# EAGLE design teensyShield1.4 (EAGLE 7.5.0)
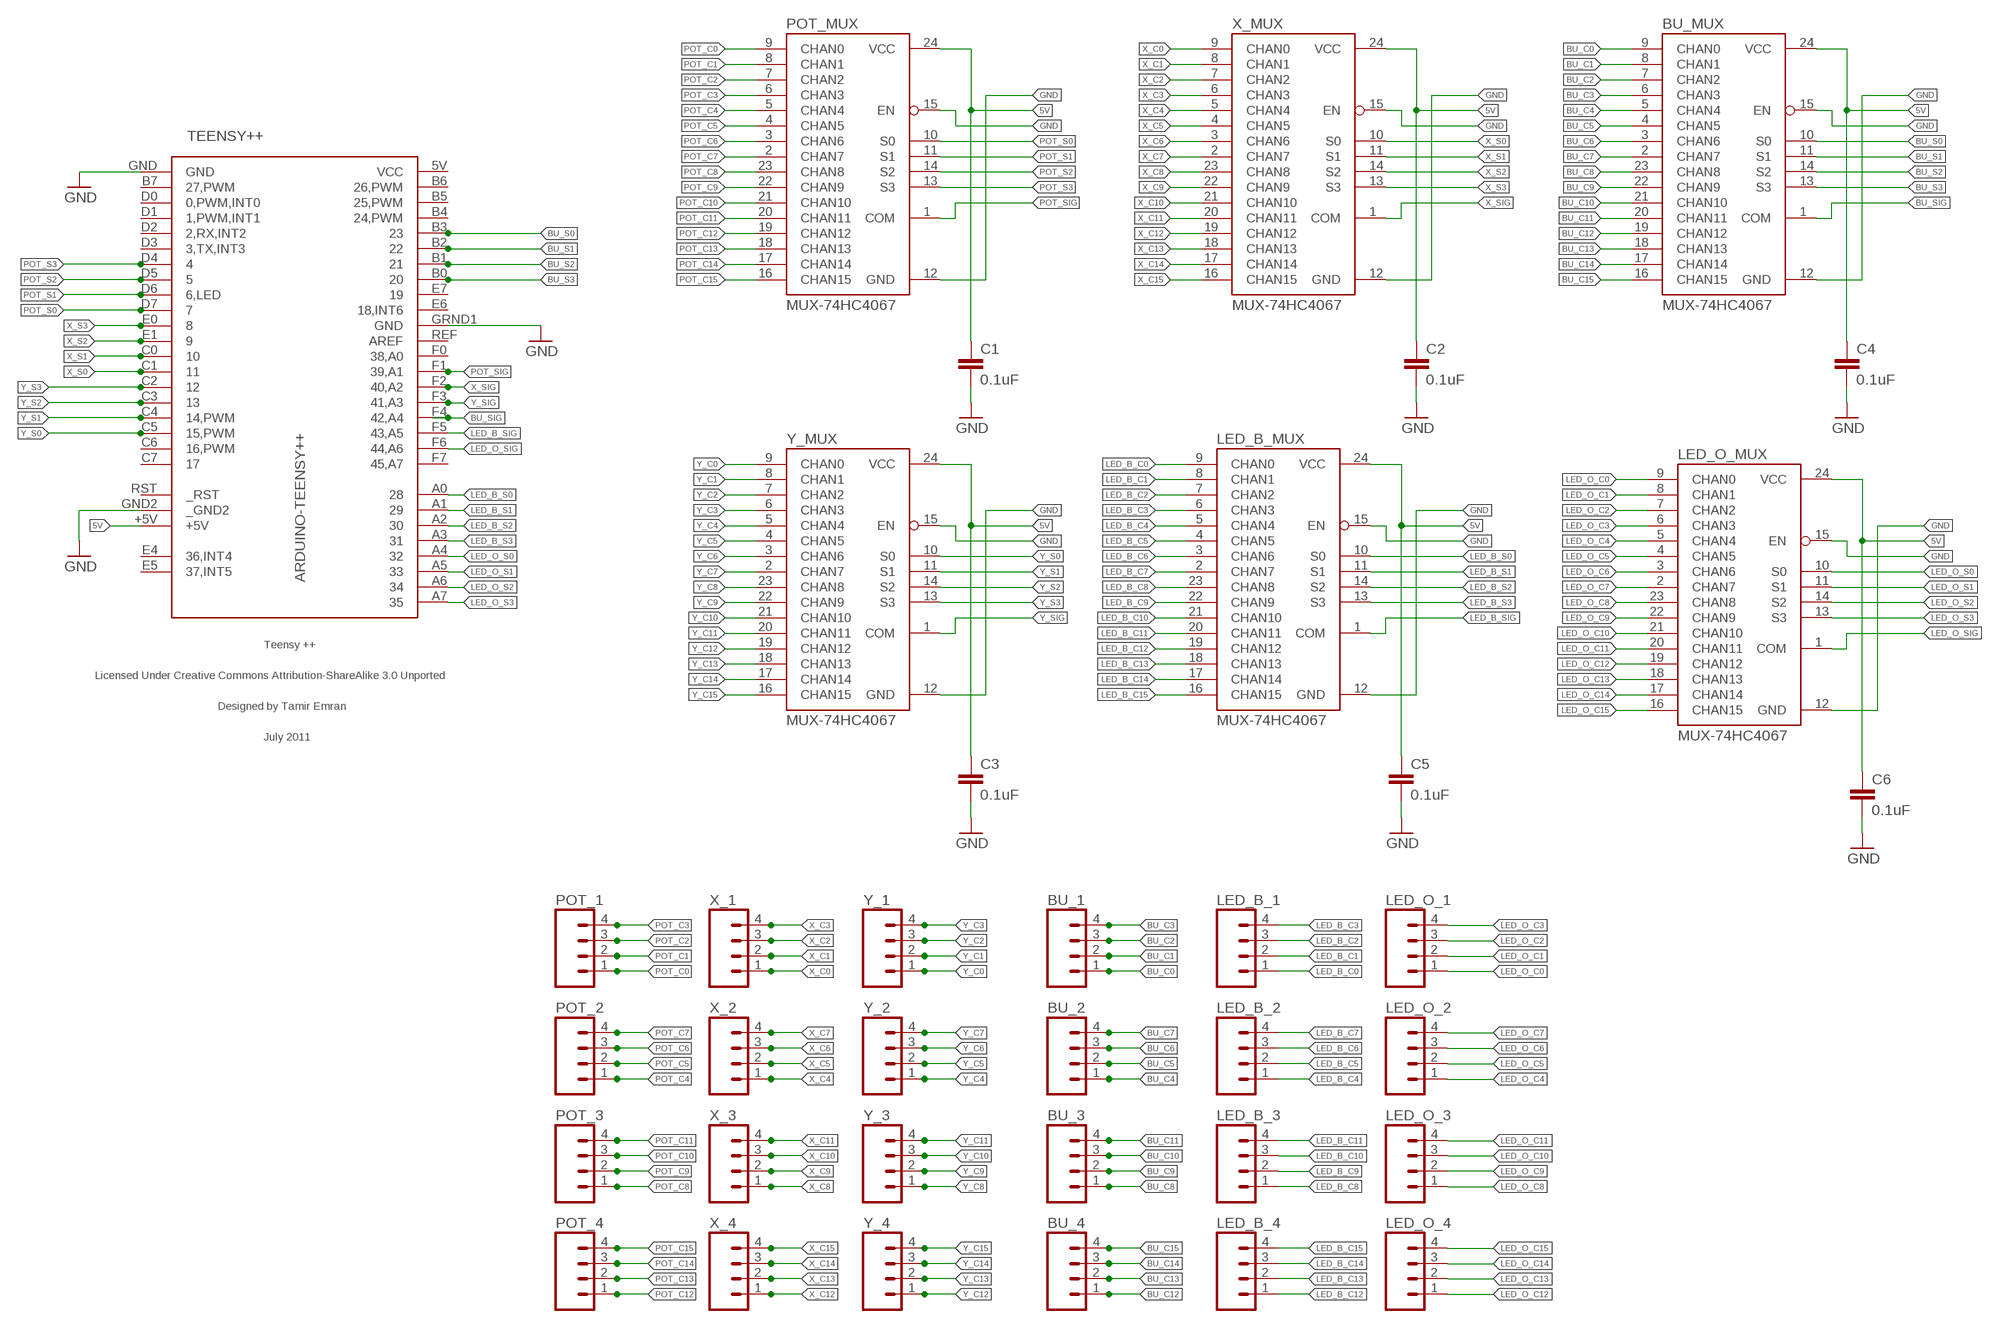
[diagram p0: schematic, sheet 1]

## Parts
BU_1  M04NO_SILK_ALL_ROUND  [1X04_NO_SILK_ALL_ROUND]
BU_2  M04NO_SILK_ALL_ROUND  [1X04_NO_SILK_ALL_ROUND]
BU_3  M04NO_SILK_ALL_ROUND  [1X04_NO_SILK_ALL_ROUND]
BU_4  M04NO_SILK_ALL_ROUND  [1X04_NO_SILK_ALL_ROUND]
BU_MUX  MUX-74HC4067  MUX-74HC4067SMD  [SSOP24]
C1  0.1uF  CAP0603  [0603]
C2  0.1uF  CAP0603  [0603]
C3  0.1uF  CAP0603  [0603]
C4  0.1uF  CAP0603  [0603]
C5  0.1uF  CAP0603  [0603]
C6  0.1uF  CAP0603  [0603]
LED_B_1  M04NO_SILK_ALL_ROUND  [1X04_NO_SILK_ALL_ROUND]
LED_B_2  M04NO_SILK_ALL_ROUND  [1X04_NO_SILK_ALL_ROUND]
LED_B_3  M04NO_SILK_ALL_ROUND  [1X04_NO_SILK_ALL_ROUND]
LED_B_4  M04NO_SILK_ALL_ROUND  [1X04_NO_SILK_ALL_ROUND]
LED_B_MUX  MUX-74HC4067  MUX-74HC4067SMD  [SSOP24]
LED_O_1  M04NO_SILK_ALL_ROUND  [1X04_NO_SILK_ALL_ROUND]
LED_O_2  M04NO_SILK_ALL_ROUND  [1X04_NO_SILK_ALL_ROUND]
LED_O_3  M04NO_SILK_ALL_ROUND  [1X04_NO_SILK_ALL_ROUND]
LED_O_4  M04NO_SILK_ALL_ROUND  [1X04_NO_SILK_ALL_ROUND]
LED_O_MUX  MUX-74HC4067  MUX-74HC4067SMD  [SSOP24]
POT_1  M04NO_SILK_ALL_ROUND  [1X04_NO_SILK_ALL_ROUND]
POT_2  M04NO_SILK_ALL_ROUND  [1X04_NO_SILK_ALL_ROUND]
POT_3  M04NO_SILK_ALL_ROUND  [1X04_NO_SILK_ALL_ROUND]
POT_4  M04NO_SILK_ALL_ROUND  [1X04_NO_SILK_ALL_ROUND]
POT_MUX  MUX-74HC4067  MUX-74HC4067SMD  [SSOP24]
TEENSY++  ARDUINO-TEENSY++  [TEENSY++]
X_1  M04NO_SILK_ALL_ROUND  [1X04_NO_SILK_ALL_ROUND]
X_2  M04NO_SILK_ALL_ROUND  [1X04_NO_SILK_ALL_ROUND]
X_3  M04NO_SILK_ALL_ROUND  [1X04_NO_SILK_ALL_ROUND]
X_4  M04NO_SILK_ALL_ROUND  [1X04_NO_SILK_ALL_ROUND]
X_MUX  MUX-74HC4067  MUX-74HC4067SMD  [SSOP24]
Y_1  M04NO_SILK_ALL_ROUND  [1X04_NO_SILK_ALL_ROUND]
Y_2  M04NO_SILK_ALL_ROUND  [1X04_NO_SILK_ALL_ROUND]
Y_3  M04NO_SILK_ALL_ROUND  [1X04_NO_SILK_ALL_ROUND]
Y_4  M04NO_SILK_ALL_ROUND  [1X04_NO_SILK_ALL_ROUND]
Y_MUX  MUX-74HC4067  MUX-74HC4067SMD  [SSOP24]

## Nets
5V: BU_MUX.24(VCC) C1.1 C2.1 C3.1 C4.1 C5.1 C6.1 LED_B_MUX.24(VCC) LED_O_MUX.24(VCC) POT_MUX.24(VCC) X_MUX.24(VCC) Y_MUX.24(VCC)
BU_C0: BU_1.1 BU_MUX.9(CHAN0)
BU_C1: BU_1.2 BU_MUX.8(CHAN1)
BU_C2: BU_1.3 BU_MUX.7(CHAN2)
BU_C3: BU_1.4 BU_MUX.6(CHAN3)
BU_C4: BU_2.1 BU_MUX.5(CHAN4)
BU_C5: BU_2.2 BU_MUX.4(CHAN5)
BU_C6: BU_2.3 BU_MUX.3(CHAN6)
BU_C7: BU_2.4 BU_MUX.2(CHAN7)
BU_C8: BU_3.1 BU_MUX.23(CHAN8)
BU_C9: BU_3.2 BU_MUX.22(CHAN9)
BU_C10: BU_3.3 BU_MUX.21(CHAN10)
BU_C11: BU_3.4 BU_MUX.20(CHAN11)
BU_C12: BU_4.1 BU_MUX.19(CHAN12)
BU_C13: BU_4.2 BU_MUX.18(CHAN13)
BU_C14: BU_4.3 BU_MUX.17(CHAN14)
BU_C15: BU_4.4 BU_MUX.16(CHAN15)
BU_S0: BU_MUX.10(S0) TEENSY++.B3
BU_S1: BU_MUX.11(S1) TEENSY++.B2
BU_S2: BU_MUX.14(S2) TEENSY++.B1
BU_S3: BU_MUX.13(S3) TEENSY++.B0
BU_SIG: BU_MUX.1(COM) TEENSY++.F4(42,A4)
GND: BU_MUX.12(GND) BU_MUX.15(EN) C1.2 C2.2 C3.2 C4.2 C5.2 C6.2 LED_B_MUX.12(GND) LED_B_MUX.15(EN) LED_O_MUX.12(GND) LED_O_MUX.15(EN) POT_MUX.12(GND) POT_MUX.15(EN) TEENSY++.GND TEENSY++.GND2(_GND2) TEENSY++.GRND1(GND) X_MUX.12(GND) X_MUX.15(EN) Y_MUX.12(GND) Y_MUX.15(EN)
LED_B_C0: LED_B_1.1 LED_B_MUX.9(CHAN0)
LED_B_C1: LED_B_1.2 LED_B_MUX.8(CHAN1)
LED_B_C2: LED_B_1.3 LED_B_MUX.7(CHAN2)
LED_B_C3: LED_B_1.4 LED_B_MUX.6(CHAN3)
LED_B_C4: LED_B_2.1 LED_B_MUX.5(CHAN4)
LED_B_C5: LED_B_2.2 LED_B_MUX.4(CHAN5)
LED_B_C6: LED_B_2.3 LED_B_MUX.3(CHAN6)
LED_B_C7: LED_B_2.4 LED_B_MUX.2(CHAN7)
LED_B_C8: LED_B_3.1 LED_B_MUX.23(CHAN8)
LED_B_C9: LED_B_3.2 LED_B_MUX.22(CHAN9)
LED_B_C10: LED_B_3.3 LED_B_MUX.21(CHAN10)
LED_B_C11: LED_B_3.4 LED_B_MUX.20(CHAN11)
LED_B_C12: LED_B_4.1 LED_B_MUX.19(CHAN12)
LED_B_C13: LED_B_4.2 LED_B_MUX.18(CHAN13)
LED_B_C14: LED_B_4.3 LED_B_MUX.17(CHAN14)
LED_B_C15: LED_B_4.4 LED_B_MUX.16(CHAN15)
LED_B_S0: LED_B_MUX.10(S0) TEENSY++.A0
LED_B_S1: LED_B_MUX.11(S1) TEENSY++.A1
LED_B_S2: LED_B_MUX.14(S2) TEENSY++.A2
LED_B_S3: LED_B_MUX.13(S3) TEENSY++.A3
LED_B_SIG: LED_B_MUX.1(COM)
LED_O_C0: LED_O_1.1 LED_O_MUX.9(CHAN0)
LED_O_C1: LED_O_1.2 LED_O_MUX.8(CHAN1)
LED_O_C2: LED_O_1.3 LED_O_MUX.7(CHAN2)
LED_O_C3: LED_O_1.4 LED_O_MUX.6(CHAN3)
LED_O_C4: LED_O_2.1 LED_O_MUX.5(CHAN4)
LED_O_C5: LED_O_2.2 LED_O_MUX.4(CHAN5)
LED_O_C6: LED_O_2.3 LED_O_MUX.3(CHAN6)
LED_O_C7: LED_O_2.4 LED_O_MUX.2(CHAN7)
LED_O_C8: LED_O_3.1 LED_O_MUX.23(CHAN8)
LED_O_C9: LED_O_3.2 LED_O_MUX.22(CHAN9)
LED_O_C10: LED_O_3.3 LED_O_MUX.21(CHAN10)
LED_O_C11: LED_O_3.4 LED_O_MUX.20(CHAN11)
LED_O_C12: LED_O_4.1 LED_O_MUX.19(CHAN12)
LED_O_C13: LED_O_4.2 LED_O_MUX.18(CHAN13)
LED_O_C14: LED_O_4.3 LED_O_MUX.17(CHAN14)
LED_O_C15: LED_O_4.4 LED_O_MUX.16(CHAN15)
LED_O_S0: LED_O_MUX.10(S0) TEENSY++.A4
LED_O_S1: LED_O_MUX.11(S1) TEENSY++.A5
LED_O_S2: LED_O_MUX.14(S2) TEENSY++.A6
LED_O_S3: LED_O_MUX.13(S3) TEENSY++.A7
LED_O_SIG: LED_O_MUX.1(COM)
N$1: TEENSY++.F2(40,A2)
N$2: TEENSY++.F1(39,A1)
N$3: TEENSY++.F5(43,A5)
N$4: TEENSY++.+5V
N$5: TEENSY++.F6(44,A6)
POT_C0: POT_1.1 POT_MUX.9(CHAN0)
POT_C1: POT_1.2 POT_MUX.8(CHAN1)
POT_C2: POT_1.3 POT_MUX.7(CHAN2)
POT_C3: POT_1.4 POT_MUX.6(CHAN3)
POT_C4: POT_2.1 POT_MUX.5(CHAN4)
POT_C5: POT_2.2 POT_MUX.4(CHAN5)
POT_C6: POT_2.3 POT_MUX.3(CHAN6)
POT_C7: POT_2.4 POT_MUX.2(CHAN7)
POT_C8: POT_3.1 POT_MUX.23(CHAN8)
POT_C9: POT_3.2 POT_MUX.22(CHAN9)
POT_C10: POT_3.3 POT_MUX.21(CHAN10)
POT_C11: POT_3.4 POT_MUX.20(CHAN11)
POT_C12: POT_4.1 POT_MUX.19(CHAN12)
POT_C13: POT_4.2 POT_MUX.18(CHAN13)
POT_C14: POT_4.3 POT_MUX.17(CHAN14)
POT_C15: POT_4.4 POT_MUX.16(CHAN15)
POT_S0: POT_MUX.10(S0) TEENSY++.D7
POT_S1: POT_MUX.11(S1) TEENSY++.D6(6,LED)
POT_S2: POT_MUX.14(S2) TEENSY++.D5
POT_S3: POT_MUX.13(S3) TEENSY++.D4
POT_SIG: POT_MUX.1(COM)
X_C0: X_1.1 X_MUX.9(CHAN0)
X_C1: X_1.2 X_MUX.8(CHAN1)
X_C2: X_1.3 X_MUX.7(CHAN2)
X_C3: X_1.4 X_MUX.6(CHAN3)
X_C4: X_2.1 X_MUX.5(CHAN4)
X_C5: X_2.2 X_MUX.4(CHAN5)
X_C6: X_2.3 X_MUX.3(CHAN6)
X_C7: X_2.4 X_MUX.2(CHAN7)
X_C8: X_3.1 X_MUX.23(CHAN8)
X_C9: X_3.2 X_MUX.22(CHAN9)
X_C10: X_3.3 X_MUX.21(CHAN10)
X_C11: X_3.4 X_MUX.20(CHAN11)
X_C12: X_4.1 X_MUX.19(CHAN12)
X_C13: X_4.2 X_MUX.18(CHAN13)
X_C14: X_4.3 X_MUX.17(CHAN14)
X_C15: X_4.4 X_MUX.16(CHAN15)
X_S0: TEENSY++.C1 X_MUX.10(S0)
X_S1: TEENSY++.C0 X_MUX.11(S1)
X_S2: TEENSY++.E1 X_MUX.14(S2)
X_S3: TEENSY++.E0 X_MUX.13(S3)
X_SIG: X_MUX.1(COM)
Y_C0: Y_1.1 Y_MUX.9(CHAN0)
Y_C1: Y_1.2 Y_MUX.8(CHAN1)
Y_C2: Y_1.3 Y_MUX.7(CHAN2)
Y_C3: Y_1.4 Y_MUX.6(CHAN3)
Y_C4: Y_2.1 Y_MUX.5(CHAN4)
Y_C5: Y_2.2 Y_MUX.4(CHAN5)
Y_C6: Y_2.3 Y_MUX.3(CHAN6)
Y_C7: Y_2.4 Y_MUX.2(CHAN7)
Y_C8: Y_3.1 Y_MUX.23(CHAN8)
Y_C9: Y_3.2 Y_MUX.22(CHAN9)
Y_C10: Y_3.3 Y_MUX.21(CHAN10)
Y_C11: Y_3.4 Y_MUX.20(CHAN11)
Y_C12: Y_4.1 Y_MUX.19(CHAN12)
Y_C13: Y_4.2 Y_MUX.18(CHAN13)
Y_C14: Y_4.3 Y_MUX.17(CHAN14)
Y_C15: Y_4.4 Y_MUX.16(CHAN15)
Y_S0: TEENSY++.C5(15,PWM) Y_MUX.10(S0)
Y_S1: TEENSY++.C4(14,PWM) Y_MUX.11(S1)
Y_S2: TEENSY++.C3 Y_MUX.14(S2)
Y_S3: TEENSY++.C2 Y_MUX.13(S3)
Y_SIG: TEENSY++.F3(41,A3) Y_MUX.1(COM)
Unconnected: TEENSY++.B4(24,PWM) TEENSY++.B5(25,PWM) TEENSY++.B6(26,PWM) TEENSY++.B7(27,PWM) TEENSY++.C6(16,PWM) TEENSY++.C7 TEENSY++.D0(0,PWM,INT0) TEENSY++.D1(1,PWM,INT1) TEENSY++.D2(2,RX,INT2) TEENSY++.D3(3,TX,INT3) TEENSY++.E4(36,INT4) TEENSY++.E5(37,INT5) TEENSY++.E6(18,INT6) TEENSY++.E7 TEENSY++.F0(38,A0) TEENSY++.F7(45,A7) TEENSY++.REF(AREF) TEENSY++.RST(_RST)

## Power pins joined to a net without a drawn wire
VCC: TEENSY++.5V(VCC)

## Library data of the parts
BU_1-BU_4 LED_B_1-LED_B_4 LED_O_1-LED_O_4 POT_1-POT_4 X_1-X_4 Y_1-Y_4 = SparkFun-Connectors:M04: Header 4 Standard 4-pin 0.1" header. Use with straight break away headers (SKU : PRT-00116), right angle break away headers (PRT-00553), swiss pins (PRT-00743), machine pins (PRT-00117), and female headers (PRT-00115). Molex polarized connector foot print use with SKU : PRT-08231 with associated crimp pins and housings. 1MM SMD Version SKU: PRT-10208; PROD_ID: CONN-09696
BU_MUX LED_B_MUX LED_O_MUX POT_MUX X_MUX Y_MUX = SparkFun:MUX-74HC4067
C1-C6 = SparkFun:CAP: Capacitor Standard 0603 ceramic capacitor, and 0.1" leaded capacitor.
TEENSY++ = teensypp:ARDUINO-TEENSY++: Teensy ++ Original Design by Mark Gross Modified Design by Tamir Emran Licensed Under Creative Commons Attribution-ShareAlike 3.0 Unported (CC BY-SA 3.0)

## Board
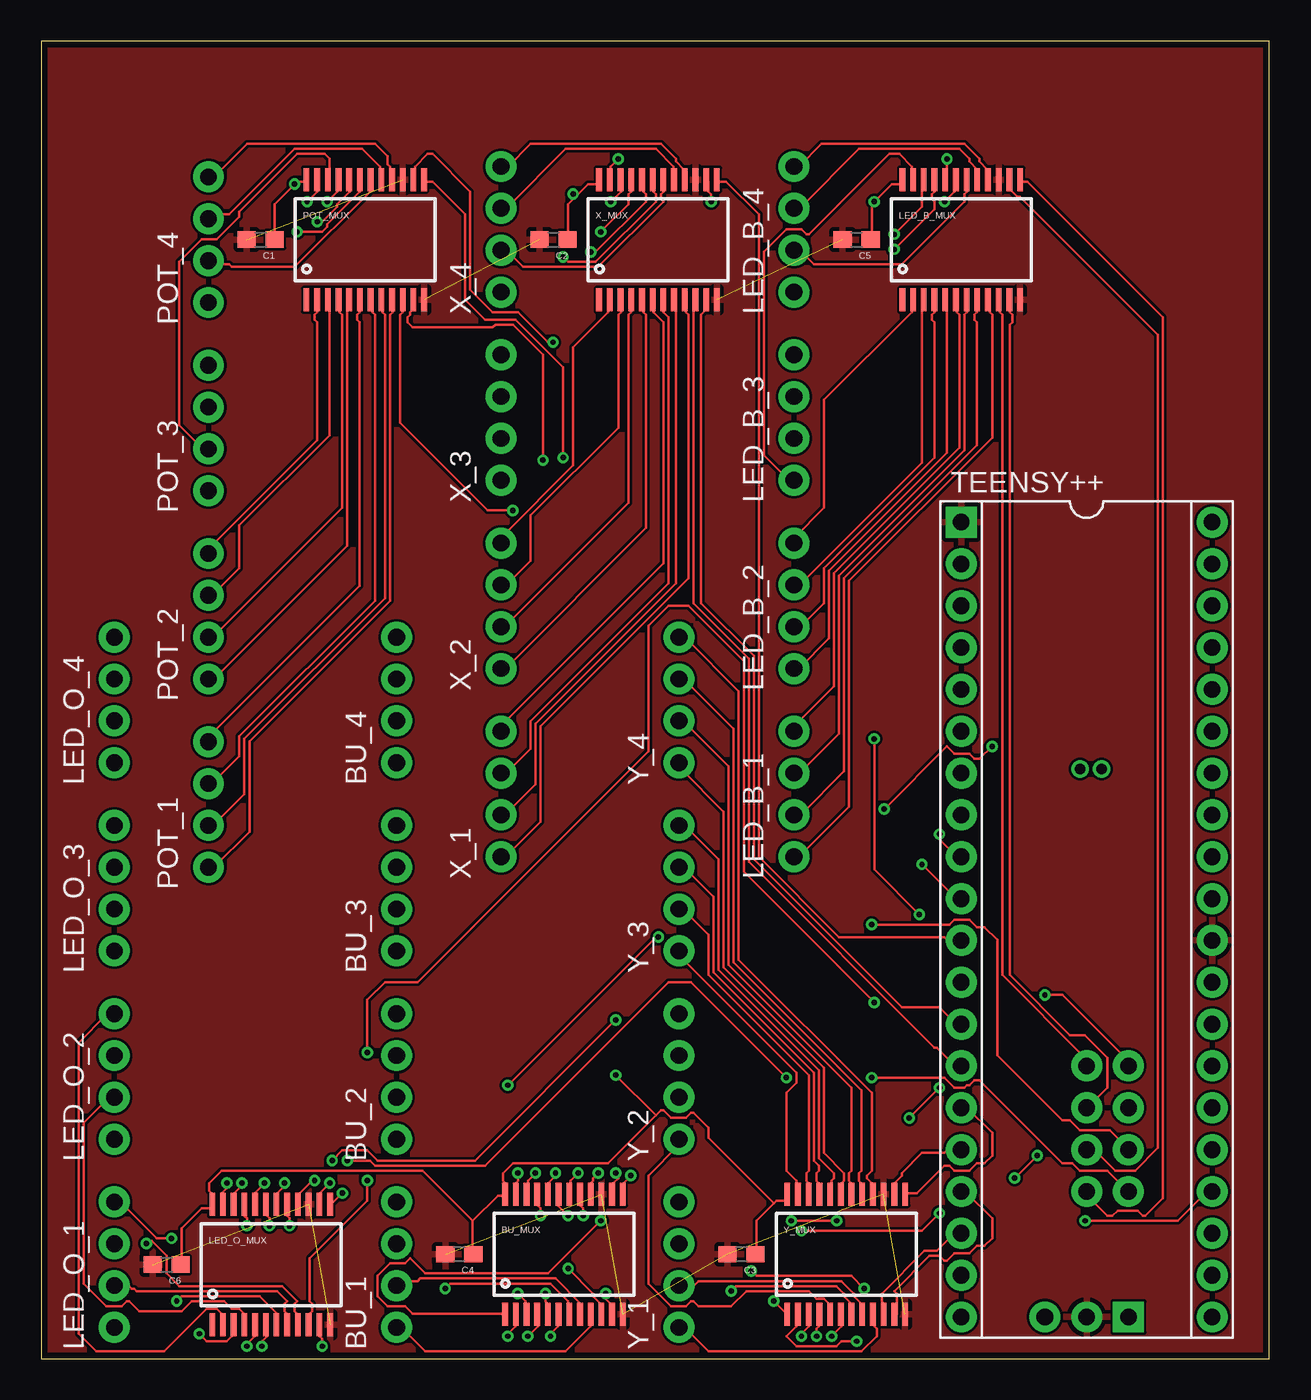
[diagram p1: board, top side]
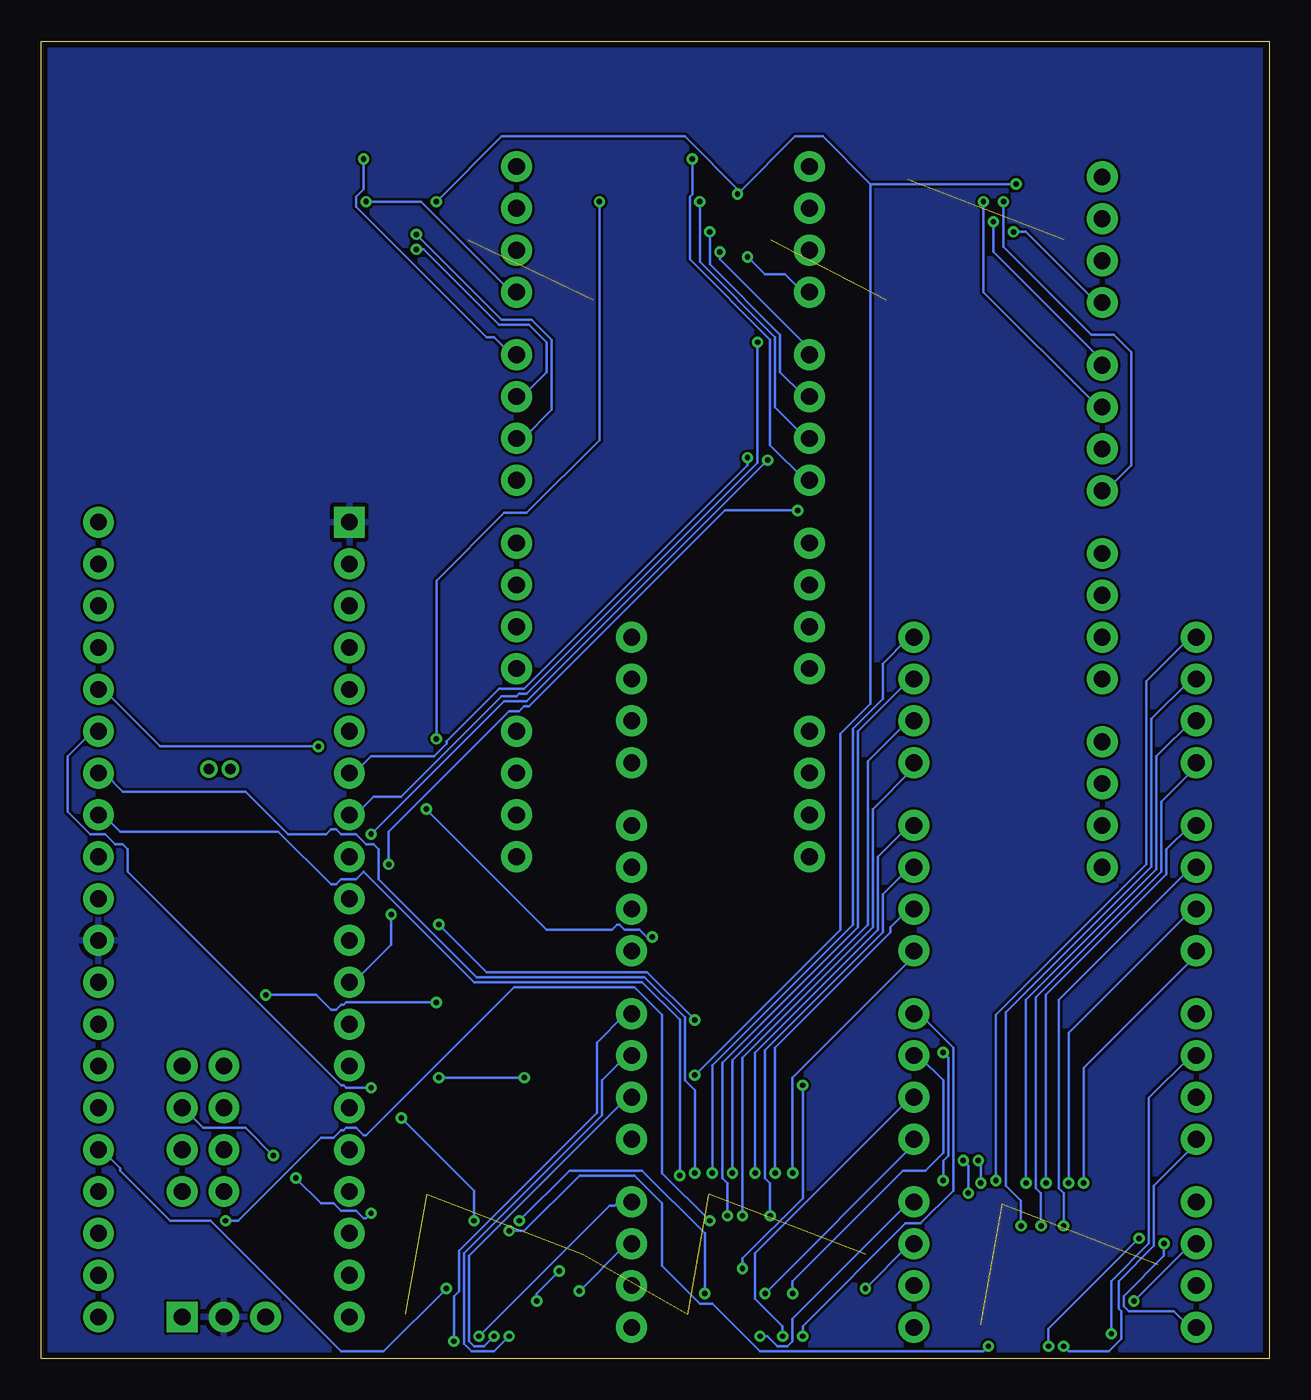
[diagram p2: board, bottom side, seen from below]

Size 74.6 x 80 mm. Coordinates in mm from the lower left corner, seen from the top.
Outline: 0,0 74.6,0 74.6,80 0,80 0,0
Copper layers (1*16): Top 0.0356mm / dielectric 1.5011mm / Bottom 0.0356mm
Design rules "oshpark-2layer": minimum track width 6mil, minimum drill 13mil, track to track 6mil, track to pad 6mil, pad to pad 6mil, via to via 6mil, smd to smd 6mil, copper to edge 15mil, drill to drill 6mil, minimum pad ring 7mil, minimum via ring 7mil, stop-mask expansion 2.5mil, vias tented up to drill 0mil, thermal gap 10mil

### Footprints (pad centres in the part's own frame; a part is rotated, then mirrored left to right if it is on the bottom)
1X04_NO_SILK_ALL_ROUND = drill 1.016 pad 1.88: 1 0,0; 2 2.54,0; 3 5.08,0; 4 7.62,0
SSOP24 = smd 0.348 x 1.397: 1 -3.575,-3.656; 2 -2.925,-3.656; 3 -2.275,-3.656; 4 -1.625,-3.656; 5 -0.975,-3.656; 6 -0.325,-3.656; 7 0.325,-3.656; 8 0.975,-3.656; 9 1.625,-3.656; 10 2.275,-3.656; 11 2.925,-3.656; 12 3.575,-3.656; 13 3.575,3.656; 14 2.925,3.656; 15 2.275,3.656; 16 1.625,3.656; 17 0.975,3.656; 18 0.325,3.656; 19 -0.325,3.656; 20 -0.975,3.656; 21 -1.625,3.656; 22 -2.275,3.656; 23 -2.925,3.656; 24 -3.575,3.656
0603 = smd 1.1 x 1: 1 -0.85,0; 2 0.85,0
TEENSY++ = drill 1.016 pad 1.88: 5V 24.13,-2.54; +5V -24.13,7.62; A0 8.89,0; A1 11.43,0; A2 13.97,0; A3 16.51,0; A4 8.89,2.54; A5 11.43,2.54; A6 13.97,2.54; A7 16.51,2.54; B0 -6.35,7.62; B1 -8.89,7.62; B2 -11.43,7.62; B3 -13.97,7.62; B4 -16.51,7.62; B5 -19.05,7.62; B6 -21.59,7.62; B7 -21.59,-7.62; C0 6.35,-7.62; C1 8.89,-7.62; C2 11.43,-7.62; C3 13.97,-7.62; C4 16.51,-7.62; C5 19.05,-7.62; C6 21.59,-7.62; C7 24.13,-7.62; D0 -19.05,-7.62; D1 -16.51,-7.62; D2 -13.97,-7.62; D3 -11.43,-7.62; D4 -8.89,-7.62; D5 -6.35,-7.62; D6 -3.81,-7.62; D7 -1.27,-7.62; E0 1.27,-7.62; E1 3.81,-7.62; E6 -1.27,7.62; E7 -3.81,7.62; F0 6.35,7.62; F1 8.89,7.62; F2 11.43,7.62; F3 13.97,7.62; F4 16.51,7.62; F5 19.05,7.62; F6 21.59,7.62; F7 24.13,7.62; GND2 24.13,0; GRND1 1.27,7.62; REF 3.81,7.62 | drill 0.635 pad 1.067: E4 -9.144,0.914; E5 -9.144,-0.406 | drill 1.016 pad 1.88 square: GND -24.13,-7.62; RST 24.13,2.54

### Placement (x,y rotation side)
BU_1  21.59,1.91 90 top
BU_2  21.59,13.34 90 top
BU_3  21.59,24.77 90 top
BU_4  21.59,36.2 90 top
BU_MUX  31.75,6.35 0 top
C1  13.34,67.94 180 top
C2  31.11,67.94 180 top
C3  42.55,6.35 180 top
C4  25.4,6.35 180 top
C5  49.53,67.94 180 top
C6  7.62,5.71 180 top
LED_B_1  45.72,30.48 90 top
LED_B_2  45.72,41.91 90 top
LED_B_3  45.72,53.34 90 top
LED_B_4  45.72,64.77 90 top
LED_B_MUX  55.88,67.94 0 top
LED_O_1  4.45,1.91 90 top
LED_O_2  4.45,13.34 90 top
LED_O_3  4.45,24.77 90 top
LED_O_4  4.45,36.2 90 top
LED_O_MUX  13.97,5.71 0 top
POT_1  10.16,29.84 90 top
POT_2  10.16,41.27 90 top
POT_3  10.16,52.7 90 top
POT_4  10.16,64.14 90 top
POT_MUX  19.68,67.94 0 top
TEENSY++  63.5,26.67 270 top
X_1  27.94,30.48 90 top
X_2  27.94,41.91 90 top
X_3  27.94,53.34 90 top
X_4  27.94,64.77 90 top
X_MUX  37.47,67.94 0 top
Y_1  38.73,1.91 90 top
Y_2  38.73,13.34 90 top
Y_3  38.73,24.77 90 top
Y_4  38.73,36.2 90 top
Y_MUX  48.9,6.35 0 top

### Tracks (layer width: path | path; a pad name or v marks a point on that pad's centre or on a via)
5V  (via drill 0.33)
  Top 0.152: C5.1 50.44,67.97 50.44,70.1 v50.6,70.26 51.66,71.32 52.27,71.32 52.43,71.48 LED_B_MUX.24 | C1.1 14.17,67.97 14.17,70.1 v15.39,71.32 15.54,71.48 16,71.48 POT_MUX.24 | 32.46,70.56 33.22,71.32 33.83,71.32 33.98,71.48 X_MUX.24 | 32.46,70.56 32,70.1 32,67.97 C2.1 | 32.46,70.56 v32.31,70.71 | 44.5,9.45 44.65,9.6 45.11,9.6 45.41,9.91 Y_MUX.24 | 44.5,9.45 43.43,8.38 43.43,6.4 C3.1 | C6.1 8.53,5.79 8.53,7.92 9.75,9.14 10.36,9.14 10.52,9.3 LED_O_MUX.24 10.36,9.45 10.36,10.06 10.21,10.21 10.21,10.67 10.97,11.43 23.16,11.43 26.21,8.38 | 26.21,8.38 26.21,6.4 C4.1 | 26.21,8.38 27.74,9.91 28.04,9.91 BU_MUX.24 28.19,10.06 28.19,10.67 28.04,10.82 28.04,11.28 28.65,11.89 34.44,11.89 37.34,14.78 | 44.5,9.45 40.54,13.41 40.54,14.02 39.62,14.94 39.47,14.94 39.17,14.63 38.25,14.63 37.8,15.09 37.64,15.09 37.34,14.78 | 37.34,14.78 v34.9,17.22
  Bottom 0.152: 24.23,71.32 v15.39,71.32 | 24.23,71.32 27.13,74.22 28.8,74.22 32.16,70.87 | v50.6,70.26 46.63,74.22 35.51,74.22 32.16,70.87 | 32.16,70.87 v32.31,70.71 | 24.23,71.32 24.23,39.78 26.06,37.95 26.06,26.06 v34.9,17.22
BU_C0
  Top 0.152: BU_MUX.9 33.38,2.59 33.38,1.98 31.85,0.46 23.32,0.46 21.95,1.83 21.64,1.83 BU_1.1
BU_C1
  Top 0.152: BU_MUX.8 32.77,2.74 32.77,3.35 31.24,4.88 23.01,4.88 22.86,4.72 21.79,4.72 21.64,4.57 BU_1.2
BU_C2  (via drill 0.33)
  Top 0.152: v24.54,4.27 24.84,4.57 30.94,4.57 32,3.5 32,2.74 BU_MUX.7
  Bottom 0.152: v24.54,4.27 21.95,6.86 21.64,6.86 BU_1.3
BU_C3  (via drill 0.33)
  Top 0.152: v30.94,1.37 30.94,1.52 31.39,1.98 31.39,2.59 BU_MUX.6
  Bottom 0.152: v30.94,1.37 30.48,1.37 29.87,0.76 29.26,0.76 28.96,1.07 28.96,2.44 21.95,9.45 21.64,9.45 BU_1.4
BU_C4  (via drill 0.33)
  Top 0.152: v30.63,3.96 30.63,3.5 30.79,3.35 30.79,2.74 BU_MUX.5
  Bottom 0.152: v30.63,3.96 21.64,12.95 21.64,13.26 BU_2.1
BU_C5  (via drill 0.33)
  Top 0.152: v29.57,1.37 30.18,1.98 30.18,2.59 BU_MUX.4
  Bottom 0.152: v29.57,1.37 29.57,1.98 31.24,3.66 31.24,6.4 21.64,16 BU_2.2
BU_C6  (via drill 0.33)
  Top 0.152: v28.96,3.96 29.41,3.5 29.41,2.74 BU_MUX.3
  Bottom 0.152: v28.96,3.96 28.96,4.72 22.25,11.43 20.88,11.43 19.81,12.5 19.81,16.92 21.18,18.29 21.49,18.29 BU_2.3
BU_C7  (via drill 0.33)
  Top 0.152: v28.35,1.37 28.35,1.52 28.8,1.98 28.8,2.59 BU_MUX.2
  Bottom 0.152: v28.35,1.37 28.35,1.98 22.1,8.23 21.18,8.23 19.2,10.21 19.2,18.9 21.18,20.88 21.49,20.88 BU_2.4
BU_C8  (via drill 0.33)
  Top 0.152: v28.96,11.28 28.96,10.82 28.8,10.67 28.8,10.06 BU_MUX.23
  Bottom 0.152: v28.96,11.28 28.96,17.07 21.64,24.38 21.64,24.69 BU_3.1
BU_C9  (via drill 0.33)
  Top 0.152: v30.02,11.28 29.57,10.82 29.57,10.06 BU_MUX.22
  Bottom 0.152: v30.02,11.28 30.02,18.9 23.01,25.91 23.01,26.21 21.95,27.28 21.64,27.28 BU_3.2
BU_C10  (via drill 0.33)
  Top 0.152: v30.33,8.69 30.33,9.14 30.18,9.3 30.18,9.91 BU_MUX.21
  Bottom 0.152: v30.33,8.69 30.33,10.67 30.63,10.97 30.63,18.75 23.47,25.91 23.47,28.19 21.95,29.72 21.64,29.72 BU_3.3
BU_C11  (via drill 0.33)
  Top 0.152: v31.24,11.28 31.24,11.12 30.79,10.67 30.79,10.06 BU_MUX.20
  Bottom 0.152: v31.24,11.28 31.24,18.59 23.77,26.06 23.77,30.48 21.95,32.31 21.64,32.31 BU_3.4
BU_C12  (via drill 0.33)
  Top 0.152: v32,8.69 31.39,9.3 31.39,9.91 BU_MUX.19
  Bottom 0.152: v32,8.69 32,18.29 24.08,26.21 24.08,33.38 21.64,35.81 21.64,36.12 BU_4.1
BU_C13  (via drill 0.33)
  Top 0.152: v32.61,11.28 32.16,10.82 32.16,10.06 BU_MUX.18
  Bottom 0.152: v32.61,11.28 32.61,18.14 24.38,26.36 24.38,36.27 21.95,38.71 21.64,38.71 BU_4.2
BU_C14  (via drill 0.33)
  Top 0.152: v32.92,8.69 32.92,9.14 32.77,9.3 32.77,9.91 BU_MUX.17
  Bottom 0.152: v32.92,8.69 32.92,10.67 33.22,10.97 33.22,17.98 24.99,26.21 24.99,38.1 21.95,41.15 21.64,41.15 BU_4.3
BU_C15  (via drill 0.33)
  Top 0.152: v33.83,11.28 33.53,10.97 33.53,10.82 33.38,10.67 33.38,10.06 BU_MUX.16
  Bottom 0.152: v33.83,11.28 33.83,17.83 25.3,26.36 25.3,38.25 23.47,40.08 23.47,42.22 21.95,43.74 21.64,43.74 BU_4.4
BU_S0  (via drill 0.33)
  Top 0.152: v32,5.49 33.53,3.96 33.53,3.81 33.98,3.35 33.98,2.74 BU_MUX.10 | v28.35,16.61 37.34,25.6 v37.49,25.6 | v51.21,33.38 55.02,37.19 55.47,36.73 56.39,36.73 56.69,36.42 57,36.42 v57.76,37.19
  Bottom 0.152: v32,5.49 32,6.1 28.35,9.75 v28.35,16.61 | v37.49,25.6 37.64,25.45 38.25,26.06 39.17,26.06 39.47,26.36 39.62,26.36 39.93,26.06 43.89,26.06 v51.21,33.38 | v57.76,37.19 67.36,37.19 70.71,40.54 71.02,40.54 TEENSY++.B3
BU_S1  (via drill 0.33)
  Top 0.152: v34.29,3.96 34.29,3.66 34.59,3.35 34.59,2.74 BU_MUX.11 | v48.31,8.38 v45.57,8.38 | v54.56,16.46 v52.73,14.63
  Bottom 0.152: v34.29,3.96 34.29,7.62 38.1,11.43 42.52,11.43 v45.57,8.38 | v48.31,8.38 48.31,10.21 v52.73,14.63 | v54.56,16.46 56.08,16.46 56.24,16.61 56.39,16.61 69.34,29.57 69.34,30.94 69.65,31.24 70.1,31.24 70.71,31.85 71.63,31.85 73,33.22 73,36.58 71.48,38.1 TEENSY++.B2
BU_S2  (via drill 0.33)
  Top 0.152: v34.9,11.28 35.05,11.12 35.05,10.97 34.75,10.67 34.75,10.06 BU_MUX.14
  Bottom 0.152: v34.9,11.28 34.9,16.31 35.51,16.92 35.51,20.73 37.95,23.16 48.16,23.16 54.1,29.11 54.1,30.94 54.41,31.24 54.86,31.24 55.47,31.85 56.39,31.85 56.69,32.16 57,32.16 57.3,31.85 59.59,31.85 62.18,34.44 69.65,34.44 70.71,35.51 71.02,35.51 TEENSY++.B1
BU_S3  (via drill 0.33)
  Top 0.152: v35.81,11.12 35.36,10.67 35.36,10.06 BU_MUX.13
  Bottom 0.152: v35.81,11.12 35.81,20.57 38.1,22.86 48.31,22.86 55.02,29.57 55.47,29.11 56.39,29.11 56.69,28.8 57,28.8 60.2,32 69.8,32 70.71,32.92 71.02,32.92 TEENSY++.B0
BU_SIG  (via drill 0.33)
  Top 0.152: v33.98,8.38 30.79,5.18 23.32,5.18 22.4,6.1 22.1,5.79 21.18,5.79 20.42,5.03 20.42,3.81 21.03,3.2 22.1,3.2 22.55,2.74 28.04,2.74 BU_MUX.1 | v63.4,8.38 69.04,8.38 70.71,10.06 71.02,10.06 TEENSY++.F4
  Bottom 0.152: v33.98,8.38 36.88,11.28 36.88,20.88 38.56,22.55 45.87,22.55 54.86,13.56 55.02,13.56 55.47,14.02 56.08,14.02 56.24,13.87 56.39,13.87 56.84,13.41 57.61,13.41 62.64,8.38 v63.4,8.38
GND  (10 unrouted)
  pour Top: 0,0 74.93,0 74.93,80.01 0,80.01
  pour Bottom: 0,0 74.93,0 74.93,80.01 0,80.01
LED_B_C0
  Top 0.152: LED_B_1.1 46.02,30.48 49.07,33.53 49.07,47.24 57.76,55.93 57.76,63.4 57.61,63.55 57.61,64.16 LED_B_MUX.9
LED_B_C1
  Top 0.152: LED_B_MUX.8 56.84,64.16 56.84,63.55 56.69,63.4 56.69,63.09 56.84,62.94 56.84,55.47 48.77,47.4 48.77,35.66 46.18,33.07 45.72,33.07 LED_B_1.2
LED_B_C2
  Top 0.152: LED_B_MUX.7 56.24,64.16 56.24,63.55 56.08,63.4 56.08,55.17 48.46,47.55 48.46,37.95 46.18,35.66 45.72,35.66 LED_B_1.3
LED_B_C3
  Top 0.152: LED_B_1.4 45.72,38.41 48.16,40.84 48.16,47.7 55.78,55.32 55.78,63.4 55.63,63.55 55.63,64.16 LED_B_MUX.6
LED_B_C4
  Top 0.152: LED_B_2.1 46.02,41.91 47.85,43.74 47.85,47.85 55.02,55.02 55.02,64.16 LED_B_MUX.5
LED_B_C5
  Top 0.152: LED_B_MUX.4 54.25,64.16 54.25,63.55 54.1,63.4 54.1,63.09 54.25,62.94 54.25,54.71 47.55,48.01 47.55,45.87 46.18,44.5 45.72,44.5 LED_B_2.2
LED_B_C6
  Top 0.152: LED_B_MUX.3 53.49,64.16 53.49,54.41 46.18,47.09 45.72,47.09 LED_B_2.3
LED_B_C7
  Top 0.152: LED_B_2.4 45.72,49.84 47.55,51.66 47.55,58.22 52.88,63.55 52.88,64.16 LED_B_MUX.2
LED_B_C8
  Top 0.152: LED_B_3.1 45.41,53.34 43.89,54.86 43.89,67.21 45.26,68.58 46.18,68.58 46.48,68.28 46.63,68.28 51.51,73.15 52.12,73.15 52.88,72.39 52.88,71.63 LED_B_MUX.23
LED_B_C9  (via drill 0.33)
  Top 0.152: v51.82,68.28 53.49,69.95 53.49,71.48 LED_B_MUX.22
  Bottom 0.152: v51.82,68.28 46.63,63.09 44.81,63.09 43.59,61.87 43.59,57.61 45.26,55.93 45.72,55.93 LED_B_3.2
LED_B_C10  (via drill 0.33)
  Top 0.152: v51.82,67.36 54.25,69.8 54.25,70.26 54.1,70.41 54.1,70.71 54.25,70.87 54.25,71.48 LED_B_MUX.21
  Bottom 0.152: v51.82,67.36 51.36,67.36 46.79,62.79 44.96,62.79 43.89,61.72 43.89,59.89 45.26,58.52 45.72,58.52 LED_B_3.3
LED_B_C11  (via drill 0.33)
  Top 0.152: v55.02,72.85 55.02,71.63 LED_B_MUX.20
  Bottom 0.152: v55.02,72.85 55.02,71.02 55.47,70.56 55.47,69.95 47.55,62.03 47.09,62.03 46.02,60.96 LED_B_3.4
LED_B_C12  (via drill 0.33)
  Top 0.152: v54.86,70.26 55.47,70.87 55.47,71.48 LED_B_MUX.19
  Bottom 0.152: v54.86,70.26 51.51,70.26 46.02,64.77 LED_B_4.1
LED_B_C13
  Top 0.152: LED_B_MUX.18 56.24,71.48 56.24,70.87 56.08,70.71 56.08,70.26 52.27,66.45 46.94,66.45 46.18,67.21 45.72,67.21 LED_B_4.2
LED_B_C14
  Top 0.152: LED_B_MUX.17 56.84,71.63 56.84,72.24 56.39,72.69 56.39,72.85 55.78,73.46 49.68,73.46 46.18,69.95 45.72,69.95 LED_B_4.3
LED_B_C15
  Top 0.152: LED_B_4.4 46.02,72.39 47.4,73.76 56.08,73.76 57,72.85 57,72.69 57.45,72.24 57.45,71.63 LED_B_MUX.16
LED_B_S0
  Top 0.152: LED_B_MUX.10 58.22,64.16 58.22,63.55 58.37,63.4 58.37,23.32 63.4,18.29 63.4,17.83 TEENSY++.A0
LED_B_S1
  Top 0.152: LED_B_MUX.11 58.83,64.16 58.83,63.55 58.98,63.4 58.98,62.94 58.83,62.79 58.83,23.32 62.48,19.66 63.4,19.66 64.77,18.29 64.77,16.46 63.55,15.24 TEENSY++.A1
LED_B_S2
  Top 0.152: LED_B_MUX.14 58.83,71.48 58.83,71.02 59.28,70.56 59.44,70.56 67.82,62.18 67.82,12.8 66.45,11.43 65.23,11.43 64.01,12.65 63.55,12.65 TEENSY++.A2
LED_B_S3
  Top 0.152: LED_B_MUX.13 59.59,71.48 59.89,71.48 68.12,63.25 68.12,9.75 67.06,8.69 66.9,8.69 66.6,8.99 65.38,8.99 65.08,8.69 64.77,8.69 63.4,10.06 TEENSY++.A3
LED_O_C0  (via drill 0.33)
  Top 0.152: v6.4,7.01 6.55,7.16 6.71,7.16 7.62,6.25 7.62,5.18 8.38,4.42 14.63,4.42 15.54,3.5 15.39,3.35 15.39,2.9 15.54,2.74 15.54,2.13 LED_O_MUX.9
  Bottom 0.152: v6.4,7.01 6.4,6.25 8.84,3.81 8.84,3.2 8.53,2.9 5.79,2.9 4.88,1.98 4.57,1.98 LED_O_1.1
LED_O_C1
  Top 0.152: LED_O_MUX.8 14.94,2.13 14.94,2.74 14.78,2.9 14.78,3.35 14.94,3.5 14.33,4.12 5.79,4.12 5.64,4.27 5.49,4.27 5.33,4.42 4.57,4.42 LED_O_1.2
LED_O_C2  (via drill 0.33)
  Top 0.152: v8.23,3.5 8.53,3.81 13.26,3.81 14.33,2.74 14.33,2.13 LED_O_MUX.7
  Bottom 0.152: v8.23,3.5 4.88,6.86 4.57,6.86 LED_O_1.3
LED_O_C3  (via drill 0.33)
  Top 0.152: v13.41,0.76 13.41,1.07 13.72,1.37 13.72,1.98 LED_O_MUX.6 | v7.92,7.32 7.01,7.32 4.88,9.45 4.57,9.45 LED_O_1.4
  Bottom 0.152: v13.41,0.76 13.41,1.83 v7.92,7.32
LED_O_C4  (via drill 0.33)
  Top 0.152: v12.5,0.76 12.5,0.91 12.95,1.37 12.95,1.98 LED_O_MUX.5
  Bottom 0.152: v12.5,0.76 12.19,0.46 9.75,0.46 8.99,1.22 8.99,2.9 9.14,3.05 9.14,4.72 7.01,6.86 7.01,10.52 4.57,12.95 4.57,13.26 LED_O_2.1
LED_O_C5
  Top 0.152: LED_O_MUX.4 12.34,2.13 12.34,2.74 12.04,3.05 11.58,3.05 11.12,3.5 9.14,3.5 8.53,2.9 5.94,2.9 5.33,3.5 5.18,3.5 4.88,3.2 3.96,3.2 2.59,4.57 2.59,14.33 4.12,15.85 4.42,15.85 LED_O_2.2
LED_O_C6  (via drill 0.33)
  Top 0.152: v9.6,1.52 10.06,1.07 11.28,1.07 11.58,1.37 11.58,1.98 LED_O_MUX.3
  Bottom 0.152: v9.6,1.52 9.6,4.72 7.32,7.01 7.32,15.85 4.88,18.29 4.57,18.29 LED_O_2.3
LED_O_C7
  Top 0.152: LED_O_MUX.2 10.97,2.13 10.97,2.74 10.67,3.05 10.06,3.05 7.47,0.46 3.35,0.46 2.29,1.52 2.29,19.2 3.96,20.88 4.42,20.88 LED_O_2.4
LED_O_C8  (via drill 0.33)
  Top 0.152: v11.28,10.67 11.28,10.36 10.97,10.06 10.97,9.45 LED_O_MUX.23
  Bottom 0.152: v11.28,10.67 11.28,17.68 4.57,24.38 4.57,24.69 LED_O_3.1
LED_O_C9  (via drill 0.33)
  Top 0.152: v12.19,10.67 12.19,10.52 11.73,10.06 11.73,9.45 LED_O_MUX.22
  Bottom 0.152: v12.19,10.67 12.19,19.81 4.57,27.43 LED_O_3.2
LED_O_C10  (via drill 0.33)
  Top 0.152: v12.5,8.08 12.5,8.53 12.34,8.69 12.34,9.3 LED_O_MUX.21
  Bottom 0.152: v12.5,8.08 12.5,10.06 12.8,10.36 12.8,21.79 4.88,29.72 4.57,29.72 LED_O_3.3
LED_O_C11  (via drill 0.33)
  Top 0.152: v13.56,10.67 12.95,10.06 12.95,9.45 LED_O_MUX.20
  Bottom 0.152: v13.56,10.67 13.56,22.1 6.25,29.41 6.25,30.94 4.88,32.31 4.57,32.31 LED_O_3.4
LED_O_C12  (via drill 0.33)
  Top 0.152: v13.87,8.08 13.87,8.53 13.72,8.69 13.72,9.3 LED_O_MUX.19
  Bottom 0.152: v13.87,8.08 13.87,10.06 14.17,10.36 14.17,21.95 6.55,29.57 6.55,33.83 4.57,35.81 4.57,36.12 LED_O_4.1
LED_O_C13  (via drill 0.33)
  Top 0.152: v14.78,10.67 14.78,10.52 14.33,10.06 14.33,9.45 LED_O_MUX.18
  Bottom 0.152: v14.78,10.67 14.78,21.79 6.86,29.72 6.86,36.58 4.57,38.86 LED_O_4.2
LED_O_C14  (via drill 0.33)
  Top 0.152: v15.09,8.08 15.09,8.53 14.94,8.69 14.94,9.3 LED_O_MUX.17
  Bottom 0.152: v15.09,8.08 15.09,9.6 16,10.52 16,21.03 7.16,29.87 7.16,38.86 4.88,41.15 4.57,41.15 LED_O_4.3
LED_O_C15  (via drill 0.33)
  Top 0.152: v16.61,10.82 16.46,10.82 15.7,10.06 15.7,9.45 LED_O_MUX.16
  Bottom 0.152: v16.61,10.82 16.61,20.88 7.47,30.02 7.47,41.15 4.88,43.74 4.57,43.74 LED_O_4.4
LED_O_S0  (via drill 0.33)
  Top 0.152: v19.81,10.82 19.81,9.6 16.31,6.1 16.31,3.5 16.46,3.35 16.46,2.9 16.31,2.74 16.31,2.13 LED_O_MUX.10 | v19.81,18.59 19.81,21.79 20.88,22.86 22.86,22.86 36.88,36.88 36.88,44.5 38.1,45.72 39.32,45.72 42.67,42.37 42.67,29.57 v50.6,21.64 | v60.96,22.1 62.03,22.1 65.99,18.14 65.99,17.83 TEENSY++.A4
  Bottom 0.152: v19.81,10.82 19.81,12.04 19.51,12.34 19.51,18.29 v19.81,18.59 | v50.6,21.64 56.08,21.64 56.24,21.49 56.39,21.49 56.69,21.18 57,21.18 57.91,22.1 v60.96,22.1
LED_O_S1  (via drill 0.33)
  Top 0.152: v17.07,0.76 17.07,1.22 16.92,1.37 16.92,1.98 LED_O_MUX.11 | v46.18,7.77 53.49,7.77 v54.56,8.84 | v60.5,12.34 v59.13,10.97
  Bottom 0.152: v17.07,0.76 17.37,0.46 30.94,0.46 33.83,3.35 34.59,3.35 36.88,5.64 36.88,9.45 38.56,11.12 41.91,11.12 45.26,7.77 v46.18,7.77 | v54.56,8.84 54.86,8.53 55.02,8.53 55.47,8.99 56.39,8.99 56.84,9.45 57.61,9.45 v59.13,10.97 | v60.5,12.34 62.18,14.02 64.77,14.02 65.99,15.24 TEENSY++.A5
LED_O_S2  (via drill 0.33)
  Top 0.152: v17.53,10.67 16.92,10.06 16.92,9.45 LED_O_MUX.14 | v17.68,12.04 18.29,12.65 19.81,12.65 20.42,12.04 26.36,12.04 v34.9,20.57 | v50.44,26.36 55.17,26.36 55.47,26.67 56.39,26.67 56.84,26.21 57.3,26.21 58.06,25.45 58.06,18.44 62.03,14.48 62.48,14.48 63.09,13.87 64.92,13.87 65.99,12.8 TEENSY++.A6
  Bottom 0.152: v17.53,10.67 17.53,11.89 v17.68,12.04 | v34.9,20.57 37.8,23.47 47.55,23.47 v50.44,26.36
LED_O_S3  (via drill 0.33)
  Top 0.152: v18.29,10.06 17.68,9.45 LED_O_MUX.13 | v18.59,12.04 19.96,12.04 20.27,11.73 26.98,11.73 38.1,22.86 39.47,22.86 v45.26,17.07 | v50.44,17.07 54.86,17.07 55.47,16.46 56.08,16.46 56.24,16.61 56.39,16.61 56.69,16.92 57,16.92 62.03,11.89 62.64,11.89 63.09,11.43 64.77,11.43 TEENSY++.A7
  Bottom 0.152: v18.29,10.06 18.29,11.73 v18.59,12.04 | v50.44,17.07 v45.26,17.07
POT_C0
  Top 0.152: POT_MUX.9 21.34,64.16 21.34,63.55 21.18,63.4 21.18,46.02 12.65,37.49 12.65,32 10.52,29.87 10.21,29.87 POT_1.1
POT_C1
  Top 0.152: POT_MUX.8 20.73,64.16 20.73,63.55 20.88,63.4 20.88,46.18 12.34,37.64 12.34,34.29 10.52,32.46 10.21,32.46 POT_1.2
POT_C2
  Top 0.152: POT_MUX.7 20.12,64.16 20.12,63.55 20.27,63.4 20.27,46.02 12.04,37.8 12.04,36.58 10.52,35.05 10.21,35.05 POT_1.3
POT_C3
  Top 0.152: POT_MUX.6 19.36,64.16 19.36,63.55 19.2,63.4 19.2,63.09 19.36,62.94 19.36,46.94 10.21,37.8 10.21,37.49 POT_1.4
POT_C4
  Top 0.152: POT_MUX.5 18.59,64.16 18.59,49.38 10.52,41.3 10.21,41.3 POT_2.1
POT_C5
  Top 0.152: POT_MUX.4 18.14,64.16 18.14,63.55 18.29,63.4 18.29,51.66 10.52,43.89 10.21,43.89 POT_2.2
POT_C6
  Top 0.152: POT_MUX.3 17.53,64.16 17.53,56.08 12.04,50.6 12.04,48.01 10.52,46.48 10.21,46.48 POT_2.3
POT_C7
  Top 0.152: POT_MUX.2 16.76,64.16 16.76,63.55 16.61,63.4 16.61,63.09 16.76,62.94 16.76,55.78 10.21,49.23 10.21,48.92 POT_2.4
POT_C8  (via drill 0.33)
  Top 0.152: v16.15,70.26 16.76,70.87 16.76,71.48 POT_MUX.23
  Bottom 0.152: v16.15,70.26 16.15,67.51 10.82,62.18 9.45,62.18 8.38,61.11 8.38,54.25 10.06,52.58 POT_3.1
POT_C9
  Top 0.152: POT_MUX.22 17.53,71.63 17.53,72.85 17.22,73.15 15.54,73.15 12.04,69.65 12.04,69.34 10.67,67.97 9.75,67.97 8.38,66.6 8.38,56.69 9.75,55.32 10.06,55.32 POT_3.2
POT_C10  (via drill 0.33)
  Top 0.152: v17.37,70.26 17.98,70.87 17.98,71.48 POT_MUX.21
  Bottom 0.152: v17.37,70.26 17.37,64.77 10.52,57.91 10.21,57.91 POT_3.3
POT_C11  (via drill 0.33)
  Top 0.152: v16.76,69.04 17.07,69.04 17.98,69.95 17.98,70.1 18.75,70.87 18.75,71.48 POT_MUX.20
  Bottom 0.152: v16.76,69.04 16.76,67.21 10.21,60.66 10.21,60.35 POT_3.4
POT_C12  (via drill 0.33)
  Top 0.152: v15.54,68.43 17.07,68.43 17.37,68.73 17.37,68.89 19.36,70.87 19.36,71.48 POT_MUX.19
  Bottom 0.152: v15.54,68.43 14.78,68.43 10.52,64.16 10.21,64.16 POT_4.1
POT_C13
  Top 0.152: POT_MUX.18 19.96,71.48 19.96,70.87 15.39,66.29 11.58,66.29 11.43,66.45 10.36,66.45 10.21,66.6 POT_4.2
POT_C14
  Top 0.152: POT_MUX.17 20.57,71.63 20.57,72.39 19.51,73.46 15.39,73.46 11.43,69.49 10.36,69.49 10.21,69.34 POT_4.3
POT_C15
  Top 0.152: POT_MUX.16 21.18,71.63 21.18,72.39 21.03,72.54 21.03,73 20.27,73.76 12.5,73.76 10.52,71.78 10.21,71.78 POT_4.4
POT_S0  (via drill 0.33)
  Top 0.152: v28.65,51.51 27.13,51.51 21.79,56.84 21.79,63.4 21.95,63.55 21.95,64.16 POT_MUX.10 | v53.49,30.02 55.47,28.04 55.78,28.04 TEENSY++.D7
  Bottom 0.152: v28.65,51.51 33.07,51.51 44.96,39.62 45.26,39.62 45.57,39.32 46.18,39.32 53.49,32 v53.49,30.02
POT_S1  (via drill 0.33)
  Top 0.152: v30.48,54.56 30.48,60.96 28.65,62.79 27.58,62.79 27.43,62.64 22.55,62.64 22.25,62.94 22.25,63.25 22.4,63.4 22.4,63.55 22.55,63.7 22.55,64.16 POT_MUX.11 | v54.56,31.85 54.56,31.55 55.63,30.48 TEENSY++.D6
  Bottom 0.152: v30.48,54.56 45.11,39.93 46.48,39.93 v54.56,31.85
POT_S2  (via drill 0.33)
  Top 0.152: v31.09,61.72 30.79,61.72 28.96,63.55 27.43,63.55 26.06,64.92 26.06,70.87 23.77,73.15 23.47,73.15 22.71,72.39 22.71,71.63 POT_MUX.14
  Bottom 0.152: v31.09,61.72 31.09,54.41 45.11,40.39 45.57,40.39 45.72,40.23 46.63,40.23 52.73,34.14 54.41,34.14 55.47,33.07 55.78,33.07 TEENSY++.D5
POT_S3  (via drill 0.33)
  Top 0.152: v31.7,54.71 31.7,60.2 28.8,63.09 26.98,63.09 25.76,64.31 25.76,69.49 23.77,71.48 23.32,71.48 POT_MUX.13
  Bottom 0.152: v31.7,54.71 31.7,54.25 45.26,40.69 46.79,40.69 49.99,37.49 49.99,37.34 50.75,36.58 54.56,36.58 55.47,35.66 55.78,35.66 TEENSY++.D4
X_C0
  Top 0.152: X_1.1 28.19,30.48 30.33,32.61 30.33,38.41 39.32,47.4 39.32,63.4 39.17,63.55 39.17,64.16 X_MUX.9
X_C1
  Top 0.152: X_MUX.8 38.56,64.16 38.56,47.09 30.02,38.56 30.02,34.9 28.04,32.92 X_1.2
X_C2
  Top 0.152: X_MUX.7 37.8,64.16 37.8,63.55 38.1,63.25 38.1,47.09 29.72,38.71 29.72,37.03 28.35,35.66 28.04,35.66 X_1.3
X_C3
  Top 0.152: X_MUX.6 37.19,64.16 37.19,63.55 37.8,62.94 37.8,48.31 28.04,38.56 28.04,38.1 X_1.4
X_C4
  Top 0.152: X_2.1 28.19,41.91 36.73,50.44 36.73,63.4 36.58,63.55 36.58,64.16 X_MUX.5
X_C5
  Top 0.152: X_MUX.4 35.81,64.16 35.81,63.55 35.66,63.4 35.66,51.97 28.04,44.35 X_2.2
X_C6
  Top 0.152: X_MUX.3 35.2,64.16 35.2,63.55 35.05,63.4 35.05,56.54 29.72,51.21 29.72,48.46 28.35,47.09 28.04,47.09 X_2.3
X_C7
  Top 0.152: X_MUX.2 34.44,64.16 34.44,63.55 32.31,61.42 32.31,54.25 28.04,49.99 28.04,49.53 X_2.4
X_C8  (via drill 0.33)
  Top 0.152: v35.05,72.85 34.59,72.39 34.59,71.63 X_MUX.23
  Bottom 0.152: v35.05,72.85 35.05,70.71 35.2,70.56 35.2,66.75 30.33,61.87 30.33,55.47 28.19,53.34 X_3.1
X_C9  (via drill 0.33)
  Top 0.152: v34.59,70.26 35.2,70.87 35.2,71.48 X_MUX.22
  Bottom 0.152: v34.59,70.26 34.59,66.6 30.02,62.03 30.02,57.76 28.04,55.78 X_3.2
X_C10  (via drill 0.33)
  Top 0.152: v33.98,68.43 35.66,70.1 35.66,70.71 35.81,70.87 35.81,71.48 X_MUX.21
  Bottom 0.152: v33.98,68.43 33.98,66.45 29.72,62.18 29.72,59.89 28.35,58.52 28.04,58.52 X_3.3
X_C11  (via drill 0.33)
  Top 0.152: v33.38,67.21 33.68,67.21 36.73,70.26 36.73,70.71 36.58,70.87 36.58,71.48 X_MUX.20
  Bottom 0.152: v33.38,67.21 33.38,66.75 28.04,61.42 28.04,60.96 X_3.4
X_C12  (via drill 0.33)
  Top 0.152: v31.7,66.9 32,66.6 33.68,66.6 37.34,70.26 37.34,70.71 37.19,70.87 37.19,71.48 X_MUX.19
  Bottom 0.152: v31.7,66.9 30.63,65.84 29.41,65.84 28.35,64.77 X_4.1
X_C13
  Top 0.152: X_MUX.18 37.8,71.48 37.8,70.87 37.64,70.71 37.64,70.41 37.8,70.26 33.83,66.29 29.26,66.29 28.35,67.21 28.04,67.21 X_4.2
X_C14
  Top 0.152: X_MUX.17 38.41,71.63 38.41,72.39 37.34,73.46 31.85,73.46 28.35,69.95 28.04,69.95 X_4.3
X_C15
  Top 0.152: X_4.4 28.35,72.39 29.72,73.76 37.64,73.76 38.56,72.85 38.56,72.69 39.01,72.24 39.01,71.63 X_MUX.16
X_S0
  Top 0.152: X_MUX.10 39.62,64.16 39.62,45.87 42.98,42.52 42.98,30.18 54.25,18.9 54.41,18.9 55.47,17.83 55.78,17.83 TEENSY++.C1
X_S1
  Top 0.152: X_MUX.11 40.39,64.16 40.39,63.7 40.08,63.4 40.08,45.87 43.28,42.67 43.28,30.33 52.27,21.34 54.56,21.34 55.47,20.42 55.78,20.42 TEENSY++.C0
X_S2  (via drill 0.33)
  Top 0.152: v40.69,70.26 40.69,70.71 40.54,70.87 40.54,71.48 X_MUX.14 | v50.6,37.64 50.6,29.72 v53.34,26.98
  Bottom 0.152: v40.69,70.26 40.69,55.78 45.11,51.36 46.48,51.36 50.6,47.24 v50.6,37.64 | v53.34,26.98 53.34,25.15 55.63,22.86 TEENSY++.E1
X_S3
  Top 0.152: X_MUX.13 41.15,71.48 41.6,71.48 43.59,69.49 43.59,30.48 48.46,25.6 54.86,25.6 55.02,25.45 55.78,25.45 TEENSY++.E0
Y_C0
  Top 0.152: Y_MUX.9 50.6,2.59 50.6,1.98 50.75,1.83 50.75,1.37 49.84,0.46 40.54,0.46 39.17,1.83 38.86,1.83 Y_1.1
Y_C1
  Top 0.152: Y_MUX.8 49.84,2.74 49.84,3.35 49.38,3.81 49.38,3.96 48.62,4.72 39.93,4.72 39.62,4.42 38.86,4.42 Y_1.2
Y_C2  (via drill 0.33)
  Top 0.152: v41.91,4.12 42.22,4.42 48.31,4.42 48.77,3.96 48.77,3.81 49.23,3.35 49.23,2.74 Y_MUX.7
  Bottom 0.152: v41.91,4.12 39.17,6.86 38.86,6.86 Y_1.3
Y_C3  (via drill 0.33)
  Top 0.152: v48.01,1.37 48.62,1.98 48.62,2.59 Y_MUX.6
  Bottom 0.152: v48.01,1.37 40.08,9.3 39.78,9.3 39.62,9.45 38.86,9.45 Y_1.4
Y_C4
  Top 0.152: Y_MUX.5 47.85,2.74 47.85,3.35 47.55,3.66 47.09,3.66 46.63,4.12 42.82,4.12 41.91,3.2 39.93,3.2 39.62,3.5 39.47,3.5 39.17,3.2 38.25,3.2 36.88,4.57 36.88,11.12 38.71,12.95 38.71,13.26 Y_2.1
Y_C5  (via drill 0.33)
  Top 0.152: v47.09,1.37 47.09,1.83 47.24,1.98 47.24,2.59 Y_MUX.4
  Bottom 0.152: v47.09,1.37 47.7,0.76 48.31,0.76 48.62,1.07 48.62,6.25 38.86,16 Y_2.2
Y_C6  (via drill 0.33)
  Top 0.152: v46.18,1.37 46.18,1.52 46.63,1.98 46.63,2.59 Y_MUX.3
  Bottom 0.152: v46.18,1.37 47.09,0.46 48.46,0.46 48.92,0.91 48.92,6.4 40.54,14.78 40.54,16.92 39.17,18.29 38.86,18.29 Y_2.3
Y_C7  (via drill 0.33)
  Top 0.152: v49.53,1.07 48.62,1.07 48.31,0.76 45.87,0.76 45.26,1.37 45.87,1.98 45.87,2.59 Y_MUX.2
  Bottom 0.152: v49.53,1.07 49.53,3.81 49.23,4.12 49.23,6.55 40.84,14.94 40.84,19.2 39.17,20.88 38.86,20.88 Y_2.4
Y_C8
  Top 0.152: Y_MUX.23 45.87,10.06 45.87,10.82 45.26,11.43 45.26,16.15 45.87,16.76 45.87,17.37 38.86,24.38 38.86,24.69 Y_3.1
Y_C9
  Top 0.152: Y_MUX.22 46.63,10.06 46.63,10.67 46.48,10.82 46.48,11.28 46.63,11.43 46.63,17.22 40.54,23.32 40.54,25.76 38.86,27.43 Y_3.2
Y_C10
  Top 0.152: Y_MUX.21 47.24,10.06 47.24,10.67 47.09,10.82 47.09,11.28 47.24,11.43 47.24,11.73 46.94,12.04 46.94,17.37 40.84,23.47 40.84,28.04 39.17,29.72 38.86,29.72 Y_3.3
Y_C11
  Top 0.152: Y_MUX.20 48.01,10.06 48.01,10.82 48.16,10.97 48.16,11.28 47.24,12.19 47.24,17.53 41.15,23.62 41.15,30.33 39.17,32.31 38.86,32.31 Y_3.4
Y_C12
  Top 0.152: Y_MUX.19 48.62,10.06 48.62,10.67 48.77,10.82 48.77,11.28 47.55,12.5 47.55,17.68 41.45,23.77 41.45,33.22 38.86,35.81 38.86,36.12 Y_4.1
Y_C13
  Top 0.152: Y_MUX.18 49.23,10.06 49.23,10.67 49.07,10.82 49.07,11.28 49.23,11.43 49.23,16.46 41.76,23.93 41.76,35.97 38.86,38.86 Y_4.2
Y_C14
  Top 0.152: Y_MUX.17 49.84,10.06 49.84,10.67 49.68,10.82 49.68,11.28 49.84,11.43 49.84,16.31 42.06,24.08 42.06,38.25 39.17,41.15 38.86,41.15 Y_4.3
Y_C15
  Top 0.152: Y_MUX.16 50.44,10.06 50.44,10.67 50.14,10.97 50.14,11.12 50.44,11.43 50.44,16.15 42.37,24.23 42.37,40.54 39.17,43.74 38.86,43.74 Y_4.4
Y_S0
  Top 0.152: TEENSY++.C5 55.47,7.62 54.41,6.55 53.65,6.55 51.05,3.96 51.05,3.5 51.21,3.35 51.21,2.74 Y_MUX.10
Y_S1
  Top 0.152: Y_MUX.11 51.97,2.74 51.97,3.96 51.82,4.12 53.95,6.25 54.56,6.25 54.86,5.94 55.02,5.94 55.47,6.4 56.39,6.4 56.84,6.86 57.3,6.86 57.76,7.32 57.76,8.53 56.24,10.06 55.93,10.06 TEENSY++.C4
Y_S2
  Top 0.152: Y_MUX.14 51.82,10.06 51.82,10.67 52.27,11.12 52.27,11.28 53.49,12.5 54.86,12.5 55.02,12.65 55.78,12.65 TEENSY++.C3
Y_S3
  Top 0.152: TEENSY++.C2 56.24,15.24 57.76,13.72 57.76,12.34 57.3,11.89 56.84,11.89 56.39,11.43 55.47,11.43 55.17,11.73 54.86,11.73 53.19,10.06 52.58,10.06 Y_MUX.13
Y_SIG  (via drill 0.33)
  Top 0.152: v44.5,3.5 45.26,2.74 Y_MUX.1 | v43.13,5.33 43.43,5.03 49.23,5.03 v49.99,4.27
  Bottom 0.152: v44.5,3.5 44.5,3.96 v43.13,5.33 | v49.99,4.27 53.8,0.46 56.39,0.46 64.31,8.38 66.75,8.38 69.8,11.43 69.8,11.58 71.02,12.8 TEENSY++.F3